# EAGLE board Main board V4.0 (EAGLE 6.2), part 1 of 2
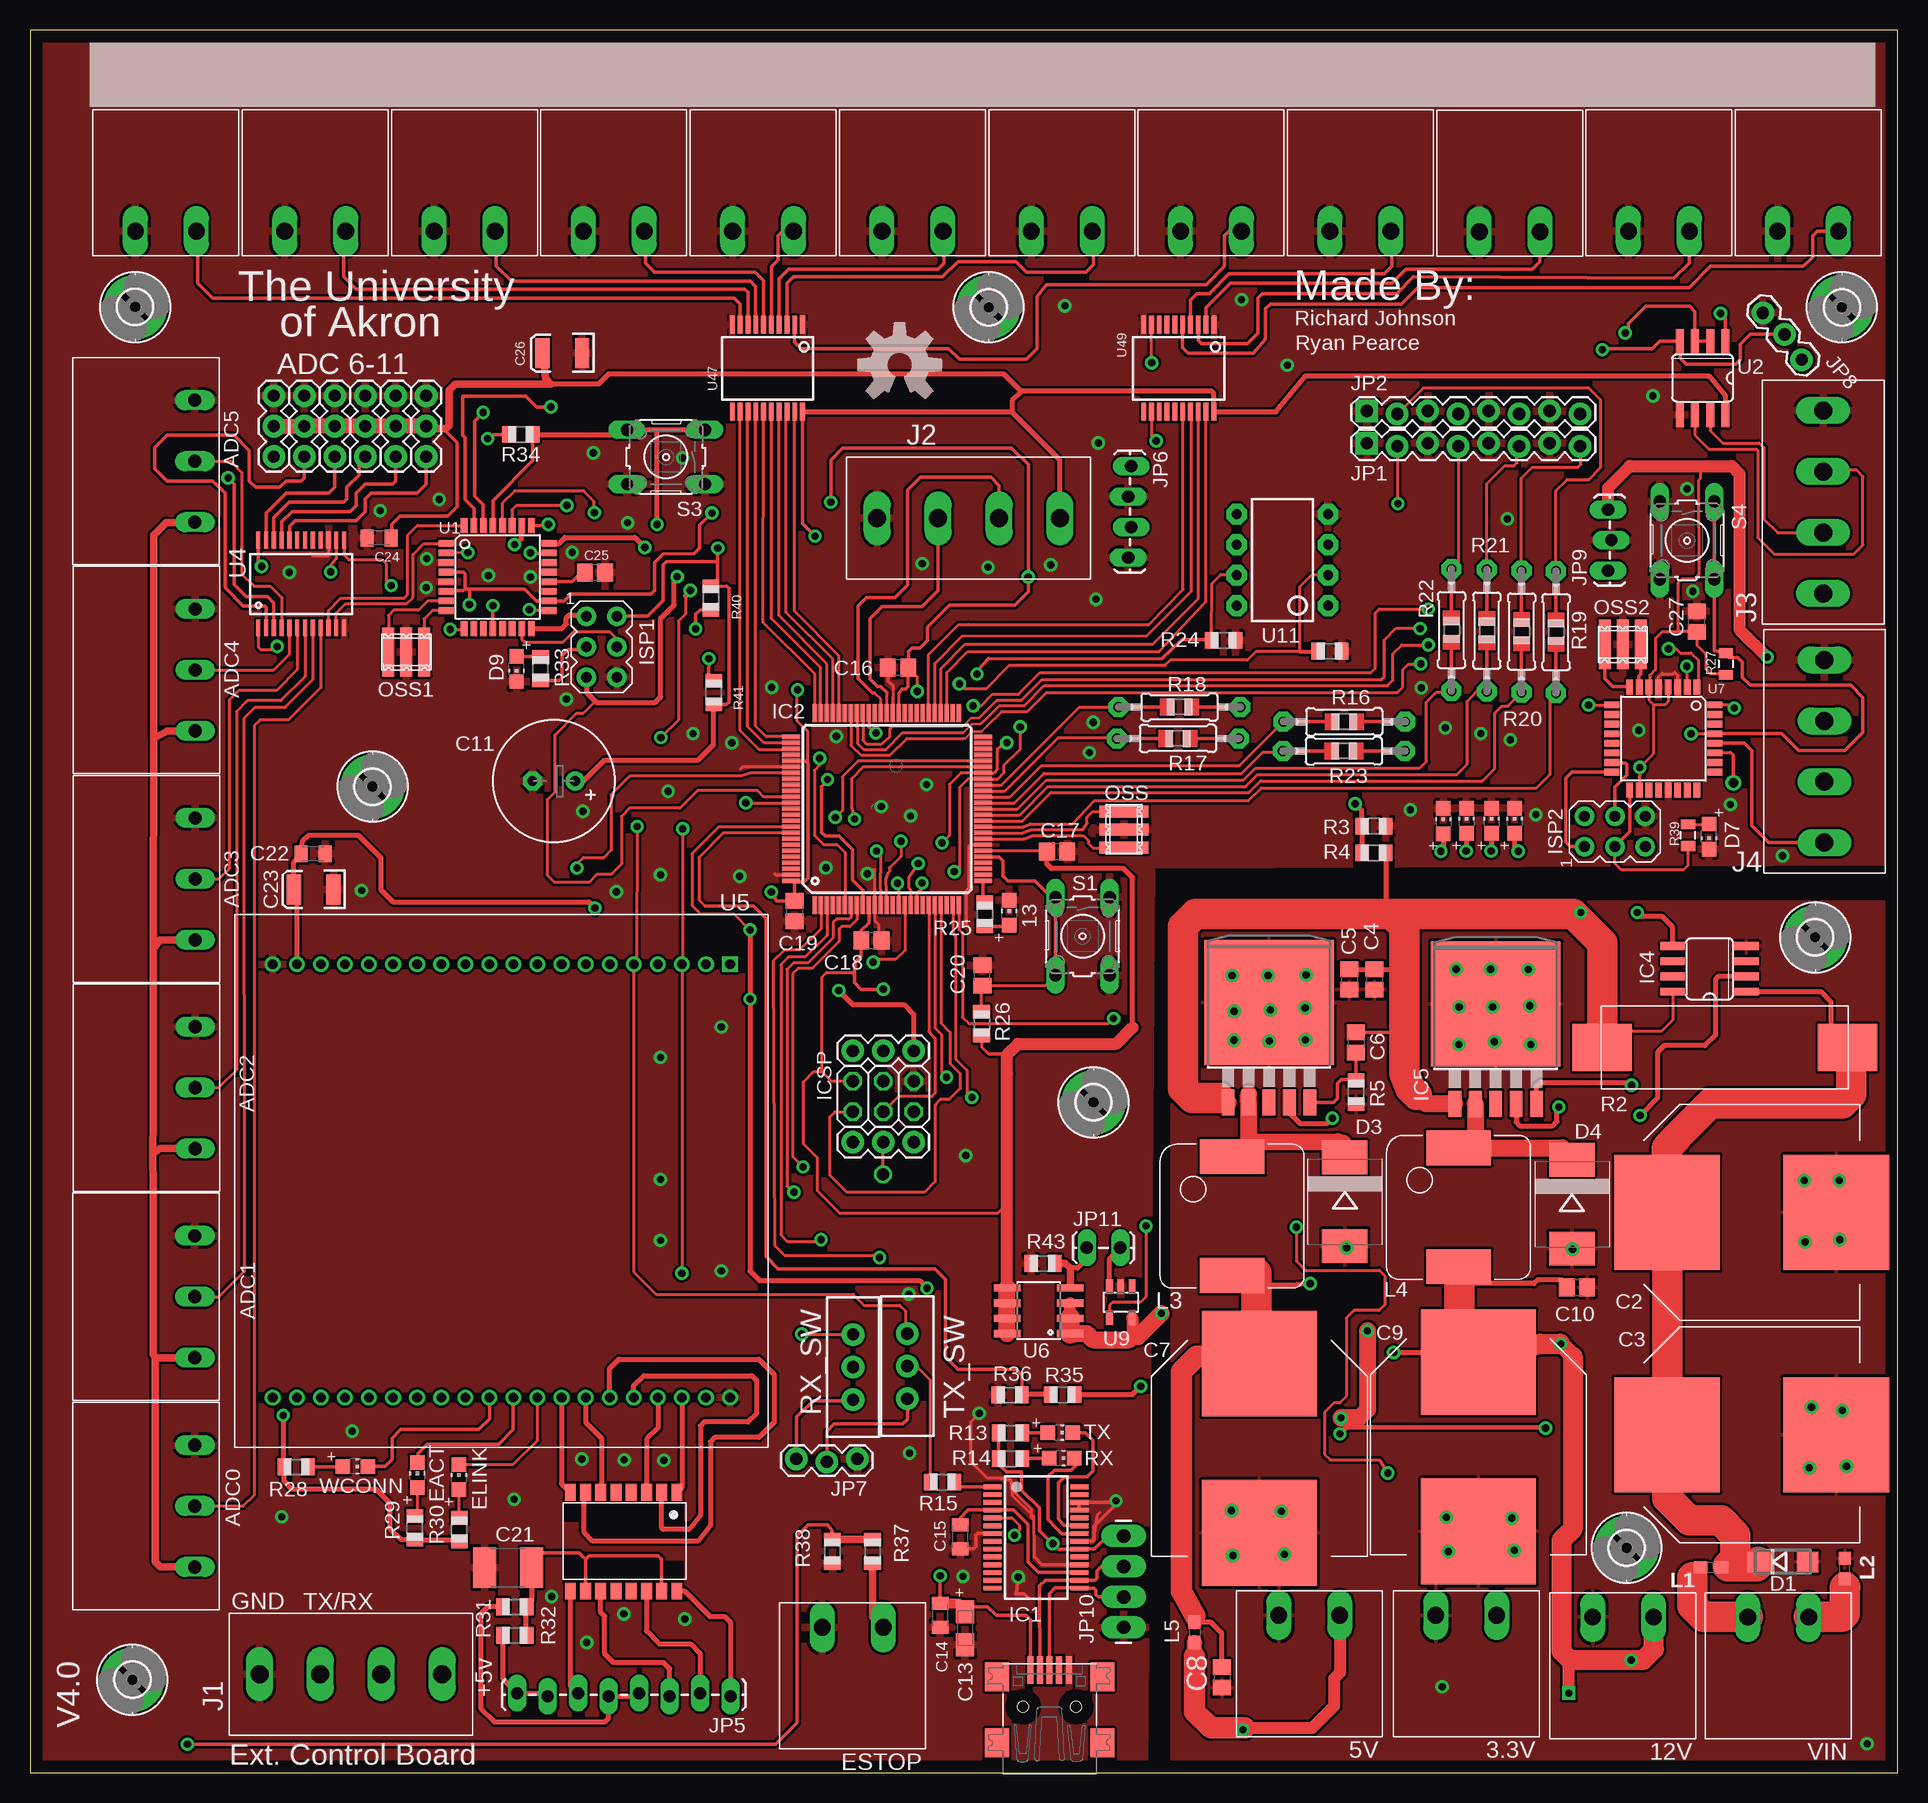
[diagram p4: board, top side]
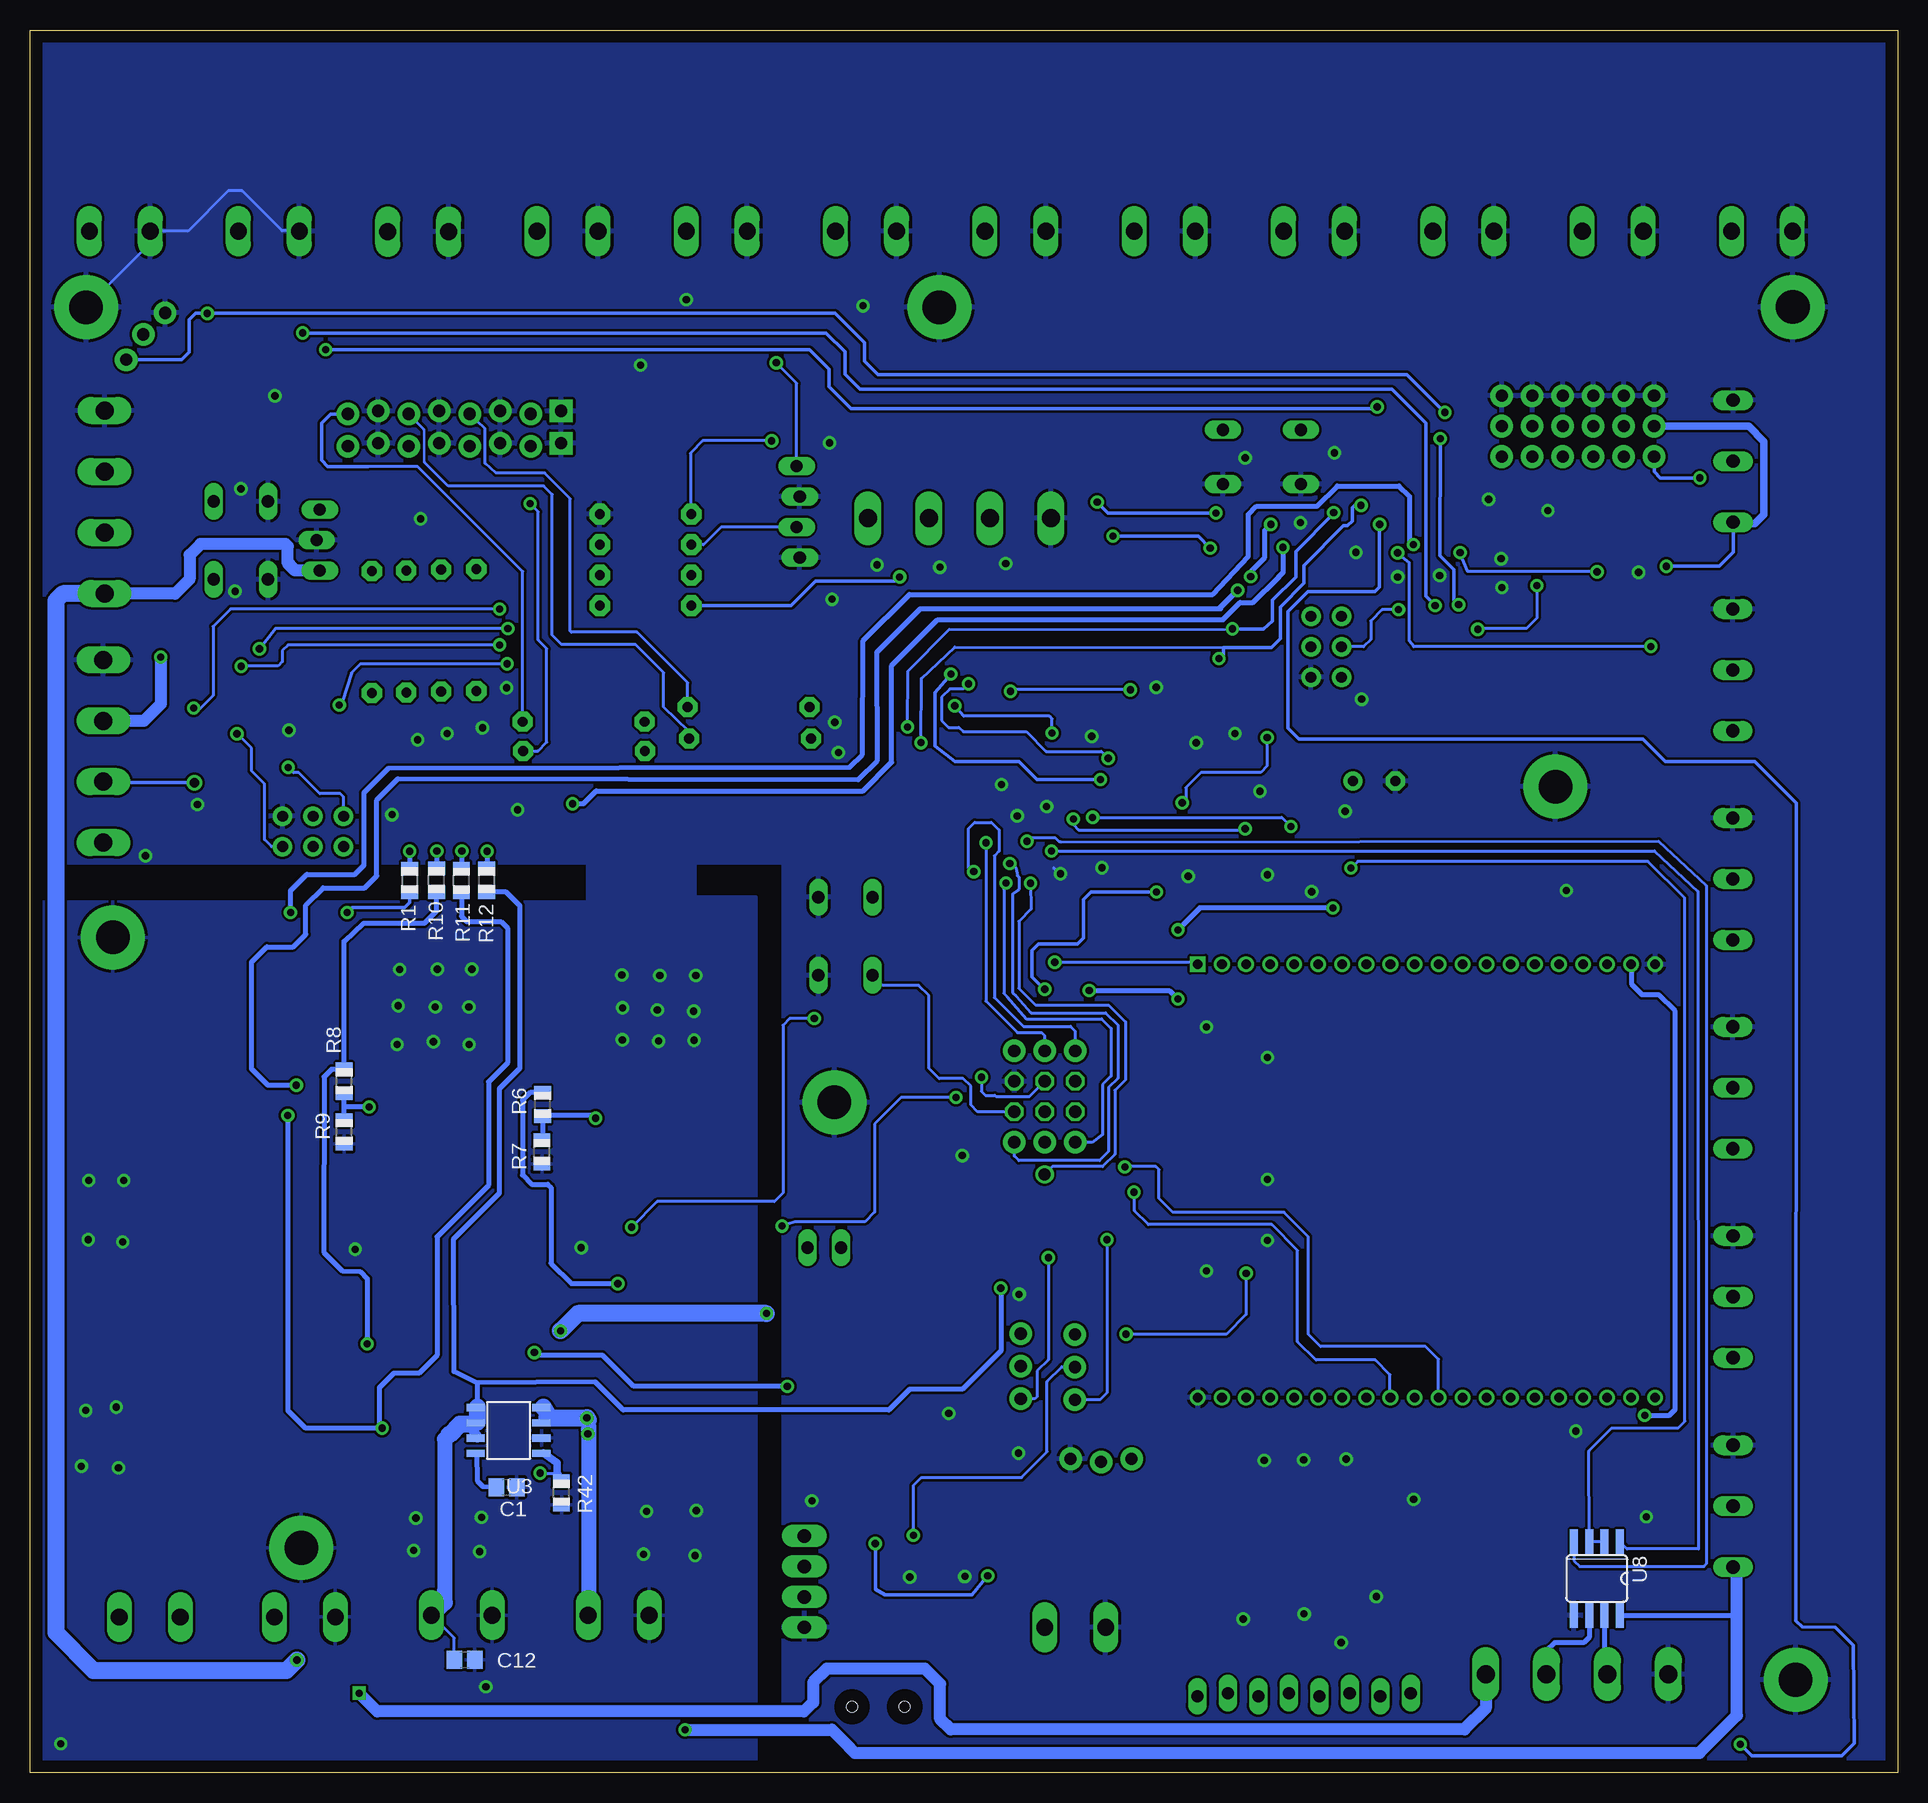
[diagram p5: board, bottom side, seen from below]

Size 155.7 x 145.29 mm. Coordinates in mm from the lower left corner, seen from the top.
Outline: 0,0 155.7,0 155.7,145.29 0,145.29 0,0
Copper layers (1*16): Top 0.035mm / dielectric 1.5mm / Bottom 0.035mm
Design rules: minimum track width 8mil, minimum drill 16mil, track to track 8mil, track to pad 8mil, pad to pad 8mil, via to via 10mil, smd to smd 8mil, copper to edge 40mil, drill to drill 12mil, minimum pad ring 10mil, minimum via ring 10mil, stop-mask expansion 4mil, vias tented up to drill 0mil, thermal gap 10mil
Net classes: 1 power: width 0.61 mm, drill 0.711 mm, clearance 0.203 mm

## Footprints (pad centres in the part's own frame; a part is rotated, then mirrored left to right if it is on the bottom)
M2 = drill 1.4 long: 1 -2.54,0; 2 2.54,0
CHIP-LED0805 = smd 1.2 x 1.2: A 0,-1.05; C 0,1.05
M3 = drill 1.1 long: 1 -5.08,0; 2 0,0; 3 5.08,0
1X03 = drill 1.016 pad 1.88: 1 0,0; 2 2.54,0; 3 5.08,0
C0805 = smd 1.3 x 1.5: 1 -0.85,0; 2 0.85,0
CAN_18MM = smd 8.8 x 9.6: + 7.05,0; - -7.05,0
E3,5-10 = drill 0.813 pad 1.6: + -1.778,0 | drill 0.813 pad 1.6 octagon: - 1.778,0
A/3216-18R = smd 1.95 x 1.5: + 1.375,0; - -1.375,0
C0805K = smd 1.1 x 1.4: 1 -1,0; 2 1,0
C1812 = smd 1.9 x 3.4: 1 -1.95,0; 2 1.95,0
EIA3528 = smd 1.2 x 2.5: A 1.65,0; C -1.65,0
USB-MINIB = smd 0.5 x 2.308: D+ 0,4.064; D- -0.8,4.064; GND 1.6,4.064; ID 0.8,4.064; VBUS -1.6,4.064 | smd 2 x 2.4: GND1 -4.4,-2; GND2 -4.4,3.5; GND3 4.4,3.5; GND4 4.4,-2 | hole 0.9: -2.2,1; 2.2,1
DO-214AC = smd 1.8 x 1.7: A 2.05,0; C -2.05,0
SMC = smd 2.8 x 3.8: A 3.7,0; C -3.7,0
2,8-PAD = drill 2.8 pad 5.334: B2,8 0,0
SSOP28 = smd 0.4 x 1.5: 1 -4.225,-3.625; 2 -3.575,-3.625; 3 -2.925,-3.625; 4 -2.275,-3.625; 5 -1.625,-3.625; 6 -0.975,-3.625; 7 -0.325,-3.625; 8 0.325,-3.625; 9 0.975,-3.625; 10 1.625,-3.625; 11 2.275,-3.625; 12 2.925,-3.625; 13 3.575,-3.625; 14 4.225,-3.625; 15 4.225,3.625; 16 3.575,3.625; 17 2.925,3.625; 18 2.275,3.625; 19 1.625,3.625; 20 0.975,3.625; 21 0.325,3.625; 22 -0.325,3.625; 23 -0.975,3.625; 24 -1.625,3.625; 25 -2.275,3.625; 26 -2.925,3.625; 27 -3.575,3.625; 28 -4.225,3.625
TQFP100 = smd 1.5 x 0.35: 1 -8,6; 2 -8,5.5; 3 -8,5; 4 -8,4.5; 5 -8,4; 6 -8,3.5; 7 -8,3; 8 -8,2.5; 9 -8,2; 10 -8,1.5; 11 -8,1; 12 -8,0.5; 13 -8,0; 14 -8,-0.5; 15 -8,-1; 16 -8,-1.5; 17 -8,-2; 18 -8,-2.5; 19 -8,-3; 20 -8,-3.5; 21 -8,-4; 22 -8,-4.5; 23 -8,-5; 24 -8,-5.5; 25 -8,-6; 51 8,-6; 52 8,-5.5; 53 8,-5; 54 8,-4.5; 55 8,-4; 56 8,-3.5; 57 8,-3; 58 8,-2.5; 59 8,-2; 60 8,-1.5; 61 8,-1; 62 8,-0.5; 63 8,0; 64 8,0.5; 65 8,1; 66 8,1.5; 67 8,2; 68 8,2.5; 69 8,3; 70 8,3.5; 71 8,4; 72 8,4.5; 73 8,5; 74 8,5.5; 75 8,6 | smd 0.35 x 1.5: 26 -6,-8; 27 -5.5,-8; 28 -5,-8; 29 -4.5,-8; 30 -4,-8; 31 -3.5,-8; 32 -3,-8; 33 -2.5,-8; 34 -2,-8; 35 -1.5,-8; 36 -1,-8; 37 -0.5,-8; 38 0,-8; 39 0.5,-8; 40 1,-8; 41 1.5,-8; 42 2,-8; 43 2.5,-8; 44 3,-8; 45 3.5,-8; 46 4,-8; 47 4.5,-8; 48 5,-8; 49 5.5,-8; 50 6,-8; 76 6,8; 77 5.5,8; 78 5,8; 79 4.5,8; 80 4,8; 81 3.5,8; 82 3,8; 83 2.5,8; 84 2,8; 85 1.5,8; 86 1,8; 87 0.5,8; 88 0,8; 89 -0.5,8; 90 -1,8; 91 -1.5,8; 92 -2,8; 93 -2.5,8; 94 -3,8; 95 -3.5,8; 96 -4,8; 97 -4.5,8; 98 -5,8; 99 -5.5,8; 100 -6,8
TO-263-5 = smd 1.067 x 2.159: 1 -3.404,-7.061; 2 -1.702,-7.061; 3 0,-7.061; 4 1.702,-7.061; 5 3.404,-7.061 | smd 10.8 x 10.41: 6 0,1.27
SO08 = smd 0.66 x 2.032: 1 -1.905,-3.073; 2 -0.635,-3.073; 3 0.635,-3.073; 4 1.905,-3.073; 5 1.905,3.073; 6 0.635,3.073; 7 -0.635,3.073; 8 -1.905,3.073
2X03 = drill 1.016 octagon: 1 -2.54,-1.27; 2 -2.54,1.27; 3 0,-1.27; 4 0,1.27; 5 2.54,-1.27; 6 2.54,1.27
AVRISP = drill 0.9 pad 1.626: 1 -1.27,2.54; 2 1.27,2.54; 3 -1.27,0; 4 1.27,0; 5 -1.27,-2.54; 6 1.27,-2.54
M4 = drill 1.5 long: P$1 0,0; P$2 5.08,0; P$3 10.16,0; P$4 15.24,0
1X08_LOCK = drill 1.016 pad 1.88 square: 1 0,0.127 | drill 1.016 pad 1.88: 2 2.54,-0.127; 3 5.08,0.127; 4 7.62,-0.127; 5 10.16,0.127; 6 12.7,-0.127; 7 15.24,0.127; 8 17.78,-0.127
1X08_LOCK_LONGPADS = drill 1.016 long: 1 0,0.127; 2 2.54,-0.127; 3 5.08,0.127; 4 7.62,-0.127; 5 10.16,0.127; 6 12.7,-0.127; 7 15.24,0.127; 8 17.78,-0.127
1X04_LOCK_LONGPADS = drill 1.016 long: 1 0,0; 2 2.54,-0.254; 3 5.08,0; 4 7.62,-0.254
1X03_LOCK = drill 1.016 pad 1.88: 1 0,0.127; 2 2.54,-0.127; 3 5.08,0.127
1X03_LOCK_LONGPADS = drill 1.016 long: 1 0,0; 2 2.54,-0.254; 3 5.08,0
1X04_LONGPADS = drill 1.118 pad 1.88 long: 1 0,0; 2 2.54,0; 3 5.08,0; 4 7.62,0
1X02_LOCK_LONGPADS = drill 1.016 long: 1 -0.127,0; 2 2.667,0
0603 = smd 1.1 x 1: 1 -0.85,0; 2 0.85,0
INDUCTOR_5X3 = smd 2.9 x 5.4: 1 -4.95,0; 2 4.95,0
AWCSR = smd 1 x 4.1: 1 -1.5,0; 2 0,0; 3 1.5,0
R0805 = smd 1.1 x 1.4: 1 -1,0; 2 1,0
RW3R5EAR100JE = smd 4.953 x 3.937: 1 -10.223,0; 2 10.223,0
0805-THM = drill 0.813 pad 1.676 octagon: 1 -5.08,0; 2 5.08,0
0805 = smd 0.8 x 1.2: 1 -0.9,0; 2 0.9,0
SWITCH-SPDT_KIT = drill 1.016 pad 1.88: 1 0,2.718; 2 0,0; 3 0,-2.718
B3F-10XX = drill 1.016 long: 1 -3.251,2.261; 2 3.251,2.261; 3 -3.251,-2.261; 4 3.251,-2.261
TQFP32-08 = smd 1.27 x 0.559: 1 -4.293,2.8; 2 -4.293,2; 3 -4.293,1.2; 4 -4.293,0.4; 5 -4.293,-0.4; 6 -4.293,-1.2; 7 -4.293,-2; 8 -4.293,-2.8; 17 4.293,-2.8; 18 4.293,-2; 19 4.293,-1.2; 20 4.293,-0.4; 21 4.293,0.4; 22 4.293,1.2; 23 4.293,2; 24 4.293,2.8 | smd 0.559 x 1.27: 9 -2.8,-4.293; 10 -2,-4.293; 11 -1.2,-4.293; 12 -0.4,-4.293; 13 0.4,-4.293; 14 1.2,-4.293; 15 2,-4.293; 16 2.8,-4.293; 25 2.8,4.293; 26 2,4.293; 27 1.2,4.293; 28 0.4,4.293; 29 -0.4,4.293; 30 -1.2,4.293; 31 -2,4.293; 32 -2.8,4.293
SO-8COOL = smd 0.61 x 1.524: 1 -1.905,-2.743; 2 -0.635,-2.743; 3 0.635,-2.743; 4 1.905,-2.743; 5 1.905,2.743; 6 0.635,2.743; 7 -0.635,2.743; 8 -1.905,2.743
SSOP24 = smd 0.348 x 1.397: 1 -3.575,-3.656; 2 -2.925,-3.656; 3 -2.275,-3.656; 4 -1.625,-3.656; 5 -0.975,-3.656; 6 -0.325,-3.656; 7 0.325,-3.656; 8 0.975,-3.656; 9 1.625,-3.656; 10 2.275,-3.656; 11 2.925,-3.656; 12 3.575,-3.656; 13 3.575,3.656; 14 2.925,3.656; 15 2.275,3.656; 16 1.625,3.656; 17 0.975,3.656; 18 0.325,3.656; 19 -0.325,3.656; 20 -0.975,3.656; 21 -1.625,3.656; 22 -2.275,3.656; 23 -2.925,3.656; 24 -3.575,3.656
LANA/BTH = drill 0.8 square: 1 -18.059,19.063 | drill 0.8: 2 18.059,19.063; 3 -18.059,17.056; 4 18.059,17.056; 5 -18.059,15.05; 6 18.059,15.05; 7 -18.059,13.043; 8 18.059,13.043; 9 -18.059,11.036; 10 18.059,11.036; 11 -18.059,9.03; 12 18.059,9.03; 13 -18.059,7.023; 14 18.059,7.023; 15 -18.059,5.016; 16 18.059,5.016; 17 -18.059,3.01; 18 18.059,3.01; 19 -18.059,1.003; 20 18.059,1.003; 21 -18.059,-1.003; 22 18.059,-1.003; 23 -18.059,-3.01; 24 18.059,-3.01; 25 -18.059,-5.016; 26 18.059,-5.016; 27 -18.059,-7.023; 28 18.059,-7.023; 29 -18.059,-9.03; 30 18.059,-9.03; 31 -18.059,-11.036; 32 18.059,-11.036; 33 -18.059,-13.043; 34 18.059,-13.043; 35 -18.059,-15.05; 36 18.059,-15.05; 37 -18.059,-17.056; 38 18.059,-17.056; 39 -18.059,-19.063; 40 18.059,-19.063
SO08' = smd 0.61 x 2.21: 1 -1.905,-2.616; 2 -0.635,-2.616; 3 0.635,-2.616; 4 1.905,-2.616; 5 1.905,2.616; 6 0.635,2.616; 7 -0.635,2.616; 8 -1.905,2.616
SOT-5L = smd 0.55 x 1.2: 1 -0.95,-1.3; 2 0,-1.3; 3 0.95,-1.3; 4 0.95,1.3; 5 -0.95,1.3
DIP08 = drill 0.813 pad 1.727 octagon: 1 -3.81,-3.81; 2 -1.27,-3.81; 3 1.27,-3.81; 4 3.81,-3.81; 5 3.81,3.81; 6 1.27,3.81; 7 -1.27,3.81; 8 -3.81,3.81
SSOP-20 = smd 0.4 x 1.5: 1 -2.925,-3.625; 2 -2.275,-3.625; 3 -1.625,-3.625; 4 -0.975,-3.625; 5 -0.325,-3.625; 6 0.325,-3.625; 7 0.975,-3.625; 8 1.625,-3.625; 9 2.275,-3.625; 10 2.925,-3.625; 11 2.925,3.625; 12 2.275,3.625; 13 1.625,3.625; 14 0.975,3.625; 15 0.325,3.625; 16 -0.325,3.625; 17 -0.975,3.625; 18 -1.625,3.625; 19 -2.275,3.625; 20 -2.925,3.625
SO-16MOD = smd 1.4 x 0.9: 1 -4.11,4.445; 2 -4.11,3.175; 3 -4.11,1.905; 4 -4.11,0.635; 5 -4.11,-0.635; 6 -4.11,-1.905; 7 -4.11,-3.175; 8 -4.11,-4.445; 9 4.11,-4.445; 10 4.11,-3.175; 11 4.11,-1.905; 12 4.11,-0.635; 13 4.11,0.635; 14 4.11,1.905; 15 4.11,3.175; 16 4.11,4.445

## Placement (x,y rotation side)
3.3V  EUROMAG-2  [M2]  119.71,13.16 180 top
5V  EUROMAG-2  [M2]  106.63,13.16 180 top
12V  EUROMAG-2  [M2]  132.79,13 180 top
13  [CHIP-LED0805]  81.61,71.7 0 top
ADC0  EUROMAG-390DEG  [M3]  13.74,22.25 90 top
ADC1  EUROMAG-390DEG  [M3]  13.74,39.7 90 top
ADC2  EUROMAG-390DEG  [M3]  13.77,57.12 90 top
ADC3  EUROMAG-390DEG  [M3]  13.77,74.52 90 top
ADC4  EUROMAG-390DEG  [M3]  13.77,91.95 90 top
ADC5  EUROMAG-390DEG  [M3]  13.74,109.35 90 top
ADC6  [1X03]  20.32,109.73 90 top
ADC7  [1X03]  22.86,109.73 90 top
ADC8  [1X03]  25.4,109.73 90 top
ADC9  [1X03]  27.94,109.73 90 top
ADC10  [1X03]  30.48,109.73 90 top
ADC11  [1X03]  33.02,109.73 90 top
C1  10nf  [C0805]  115.98,23.83 0 bottom
C2  1200uF/50v  [CAN_18MM]  143.51,46.74 180 top
C3  1200uF/50v  [CAN_18MM]  143.51,28.19 180 top
C4  1uf/50v  [C0805]  112.06,66.14 270 top
C5  1uf/50v  [C0805]  109.98,66.14 270 top
C6  0.1uF/50v  [C0805]  110.52,60.88 270 top
C7  1000uF/25v  [CAN_18MM]  102.48,27.07 90 top
C8  1uF/50v  [C0805]  99.35,7.97 270 top
C9  1000uF/25v  [CAN_18MM]  120.74,27.2 90 top
C10  1uF/50v  [C0805]  128.96,40.49 0 top
C11  10uF/16v  [E3,5-10]  43.66,82.68 180 top
C12  10uf/16v  [C0805]  119.48,9.46 0 bottom
C13  10uF  [A/3216-18R]  77.95,12.06 90 top
C14  0.1uF  [C0805K]  75.87,13.16 270 top
C15  0.1uF  [C0805K]  77.55,19.69 270 top
C16  100n  [C0805]  72.36,92.13 180 top
C17  100n  [C0805]  85.62,76.81 0 top
C18  100n  [C0805]  70.13,69.39 0 top
C19  100n  [C0805]  63.73,71.86 270 top
C20  22p  [C0805]  79.38,66.47 90 top
C21  1000pF  [C1812]  39.85,17.12 0 top
C22  0.1uf  [C0805K]  23.6,76.63 0 top
C23  10uf  [EIA3528]  23.65,73.63 180 top
C24  0.1uF  [C0805K]  29.11,102.95 180 top
C25  0.1uF  [C0805]  47.09,100.08 0 top
C26  10uF  [EIA3528]  44.37,118.36 180 top
C27  0.1uF  [C0805]  138.94,95.99 90 top
CN1  MINIB  [USB-MINIB]  84.99,4.52 0 top
D1  TVS  [DO-214AC]  146.12,17.59 0 top
D2  Vin  [CHIP-LED0805]  123.75,79.38 0 top
D3  [SMC]  109.6,47.61 270 top
D4  [SMC]  128.53,47.4 270 top
D5  5v  [CHIP-LED0805]  119.74,79.38 0 top
D6  3.3v  [CHIP-LED0805]  117.81,79.35 0 top
D7  [CHIP-LED0805]  139.95,78.05 180 top
D8  12  [CHIP-LED0805]  121.82,79.38 0 top
D9  [CHIP-LED0805]  40.56,92.02 180 top
EACT  [CHIP-LED0805]  32.28,24.83 0 top
ELINK  [CHIP-LED0805]  35.75,24.67 0 top
ESTOP  EUROMAG-2  [M2]  68.58,12.14 180 top
H2  MOUNT-PAD-ROUND2.8  [2,8-PAD]  8.53,7.77 0 top
H3  MOUNT-PAD-ROUND2.8  [2,8-PAD]  133.08,18.77 0 top
H4  MOUNT-PAD-ROUND2.8  [2,8-PAD]  151.03,122.17 0 top
H5  MOUNT-PAD-ROUND2.8  [2,8-PAD]  148.8,69.65 0 top
H6  MOUNT-PAD-ROUND2.8  [2,8-PAD]  79.91,122.17 0 top
H7  MOUNT-PAD-ROUND2.8  [2,8-PAD]  88.65,55.91 0 top
H8  MOUNT-PAD-ROUND2.8  [2,8-PAD]  28.55,82.22 0 top
H10  MOUNT-PAD-ROUND2.8  [2,8-PAD]  8.76,122.2 0 top
IC1  FT232RL  [SSOP28]  83.87,19.63 270 top
IC2  ATMEGA1280-16AU  [TQFP100]  71.42,80.37 90 top
IC3  LM2576  [TO-263-5]  103.28,62.94 0 top
IC4  MAX4080  [SO08]  140,67.03 90 top
IC5  LM2576  [TO-263-5]  122.17,62.84 0 top
ICSP  ICSP  [2X03]  71.12,56.39 0 top
ISP1  AVRISP-6  [AVRISP]  47.65,93.88 0 top
ISP2  AVRISP-6  [AVRISP]  132.11,78.49 90 top
J1  EUROMAG-4  [M4]  19.13,8.23 0 top
J2  EUROMAG-4  [M4]  70.61,104.6 0 top
J3  EUROMAG-4  [M4]  149.48,98.32 90 top
J4  I2C LED  [M4]  149.58,92.79 270 top
J19  EUROMAG-2  [M2]  11.33,128.52 0 top
J20  EUROMAG-2  [M2]  23.77,128.52 0 top
J21  EUROMAG-2  [M2]  36.22,128.52 0 top
J22  EUROMAG-2  [M2]  48.67,128.52 0 top
J23  EUROMAG-2  [M2]  61.11,128.52 0 top
J24  EUROMAG-2  [M2]  73.56,128.52 0 top
J25  EUROMAG-2  [M2]  86,128.52 0 top
J26  EUROMAG-2  [M2]  98.45,128.52 0 top
J27  EUROMAG-2  [M2]  123.34,128.47 0 top
J28  EUROMAG-2  [M2]  135.79,128.52 0 top
J29  EUROMAG-2  [M2]  110.9,128.52 0 top
J30  EUROMAG-2  [M2]  148.21,128.52 0 top
JP1  [1X08_LOCK]  111.43,110.72 0 top
JP2  [1X08_LOCK]  111.43,113.41 0 top
JP3  [1X03]  68.58,60.2 0 top
JP4  [1X03]  73.66,52.58 180 top
JP5  [1X08_LOCK_LONGPADS]  58.39,6.53 180 top
JP6  [1X04_LOCK_LONGPADS]  91.8,108.94 270 top
JP7  [1X03_LOCK]  63.88,26.06 0 top
JP8  [1X03_LOCK]  147.78,117.88 129.6 top
JP9  [1X03_LOCK_LONGPADS]  131.55,100.23 90 top
JP10  [1X04_LONGPADS]  91.15,12.14 90 top
JP11  [1X02_LOCK_LONGPADS]  88.21,43.79 0 top
L1  [0603]  140.11,17.15 0 top
L2  [0603]  151.28,17.04 90 top
L3  100uH  [INDUCTOR_5X3]  100.21,46.42 270 top
L4  100uH  [INDUCTOR_5X3]  119.08,47.16 270 top
L5  FERITEBEAD  [0603]  97.08,11.73 270 top
OSS  [AWCSR]  91.18,78.66 90 top
OSS1  [AWCSR]  31.37,93.45 0 top
OSS2  [AWCSR]  132.77,94.08 180 top
R1  1.21k  [R0805]  124.05,74.4 270 bottom
R2  POWERSHUNT  [RW3R5EAR100JE]  141.27,60.48 180 top
R3  24k  [R0805]  112.01,78.92 180 top
R4  91k  [R0805]  112.01,76.71 0 top
R5  47k  [R0805]  110.54,56.74 90 top
R6  NA  [R0805]  112.98,55.73 90 bottom
R7  NA  [R0805]  113.03,51.77 90 bottom
R8  NA  [R0805]  129.51,57.66 90 bottom
R9  NA  [R0805]  129.51,53.44 90 bottom
R10  1k  [R0805]  121.82,74.42 90 bottom
R11  1k  [R0805]  119.74,74.4 90 bottom
R12  1k  [R0805]  117.63,74.42 90 bottom
R13  1K  [R0805]  81.74,28.35 0 top
R14  1K  [R0805]  81.74,26.21 0 top
R15  10  [R0805]  76.07,24.26 0 top
R16  [0805-THM]  109.55,87.63 180 top
R17  [0805-THM]  95.68,86.23 180 top
R18  [0805-THM]  95.81,88.85 180 top
R19  [0805-THM]  127.2,95.1 270 top
R20  [0805-THM]  124.33,95.15 270 top
R21  [0805-THM]  121.44,95.22 270 top
R22  [0805-THM]  118.49,95.28 270 top
R23  [0805-THM]  109.52,85.19 180 top
R24  1k  [R0805]  99.49,94.41 0 top
R25  1k  [R0805]  79.58,71.58 270 top
R26  10k  [R0805]  79.32,62.46 270 top
R27  10K  [0805]  141.35,92.46 270 top
R28  182  [R0805]  22.2,25.53 0 top
R29  182  [R0805]  32.09,20.43 90 top
R30  182  [R0805]  35.79,20.29 90 top
R31  75  [R0805]  40.41,11.48 0 top
R32  75  [R0805]  40.41,13.84 0 top
R33  1K  [R0805]  42.57,92.05 90 top
R34  10K  [R0805]  40.92,111.58 0 top
R35  18k  [R0805]  86.08,31.55 0 top
R36  13k  [R0805]  81.69,31.52 0 top
R37  91k  [R0805]  70.23,18.47 270 top
R38  24k  [R0805]  66.88,18.47 270 top
R39  1K  [0805]  138.2,78.17 90 top
R40  2k  [R0805]  56.74,97.94 270 top
R41  2k  [R0805]  57,90.07 90 top
R42  NA  [R0805]  111.4,23.37 90 bottom
R43  NA  [R0805]  84.43,42.47 0 top
R44  1k  [R0805]  108.36,93.52 0 top
RX  Green  [CHIP-LED0805]  86,26.24 270 top
RX_SW  [SWITCH-SPDT_KIT]  68.61,33.83 0 top
S1  [B3F-10XX]  87.73,69.75 270 top
S3  [B3F-10XX]  53.01,109.7 180 top
S4  [B3F-10XX]  138.13,102.74 270 top
TX  Red  [CHIP-LED0805]  85.88,28.37 270 top
TX_SW  [SWITCH-SPDT_KIT]  73.13,33.91 0 top
U1  ATMEGA328  [TQFP32-08]  38.99,99.7 0 top
U2  MAX485SO  [SO08]  139.42,116.28 180 top
U3  ADP1706COOL  [SO-8COOL]  115.81,28.55 90 bottom
U4  MUX-74HC4067  [SSOP24]  22.61,99.11 0 top
U5  LANTRONIX_B/G  [LANA/BTH]  39.29,49.35 270 top
U6  MOSFET-PCHANNEL-SOIC8SOIC8  [SO08']  84.07,38.53 90 top
U7  ATMEGA328  [TQFP32-08]  136.14,86.23 270 top
U8  MAX485SO  [SO08]  25.1,16.21 180 bottom
U9  MAX824  [SOT-5L]  90.93,39.24 180 top
U11  ATTINY45DIP8  [DIP08]  104.39,101.12 90 top
U47  MAX6818  [SSOP-20]  61.47,117.09 180 top
U49  MAX6818  [SSOP-20]  95.76,117.09 180 top
U$3  OSHW-LOGOL  [OSHW-LOGO-L]  72.49,117.38 0 top
VIN  EUROMAG-2  [M2]  145.72,13 180 top
WCONN  [CHIP-LED0805]  27.13,25.55 270 top
X1  TLA-6T118LF  [SO-16MOD]  49.48,19.28 270 top